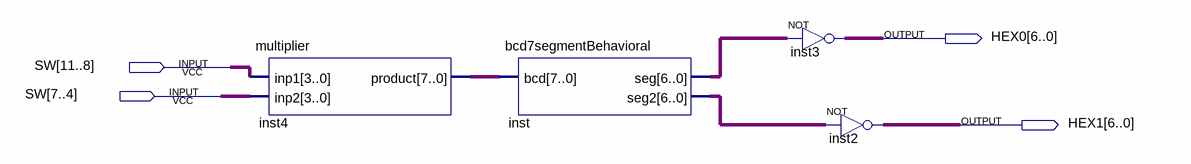
[diagram p0: schematic sheet]
// Quartus schematic multiplicador.bdf as structural Verilog: 4 symbols, 4 pins
module multiplicador (
  input  [11:4] SW,
  output [6:0] HEX0,
  output [6:0] HEX1
);

  wire [6:0] inst_seg, inst_seg2;
  wire [7:0] inst4_product;

  multiplier inst4 (.inp1(SW[11:8]), .inp2(SW[7:4]), .product(inst4_product));
  bcd7segmentBehavioral inst (.bcd(inst4_product), .seg(inst_seg), .seg2(inst_seg2));
  assign HEX0 = ~inst_seg;  // NOT inst3, 7 bits wide
  assign HEX1 = ~inst_seg2;  // NOT inst2, 7 bits wide
endmodule
